# Altium schematic sheet Std 12V.SchDoc
size A4; SheetNumber: 6; SheetTotal: 6
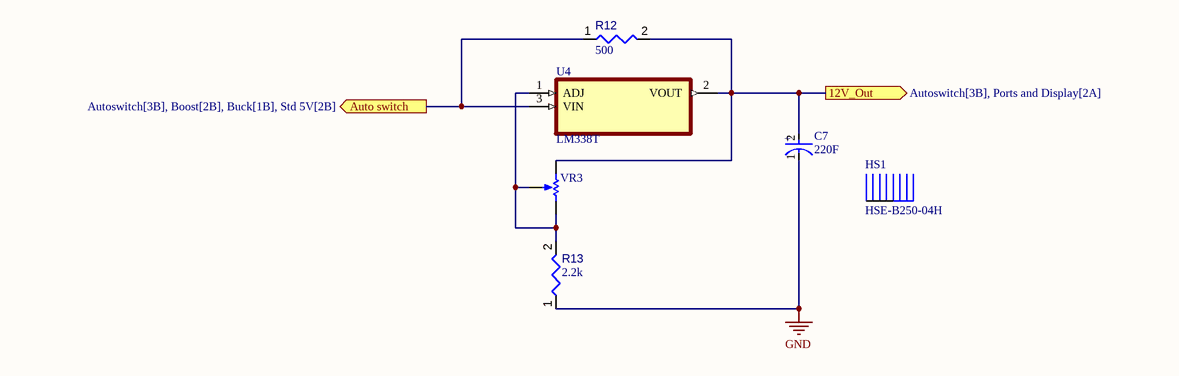
[diagram p0: Std 12V.SchDoc]

## Parts
C7  value 220F  [FP-FTF-MFG]  (hidden comment: Capacitors)
HS1  HSE-B250-04H  [HSINK_HSE-B250-04H]
R12  value 500  [RESC0805(2012)_L]  (hidden comment: 1KR5J)
R13  value 2.2k  [RESC0805(2012)_L]  (hidden comment: 1KR5J)
U4  LM338T  [TO254P1054X470X1955-3]
VR3  3362P-1-103LF  [BOUR-3362P]  (value not drawn)

## Ports
12V_Out (out, see Autoswitch[3B], Ports and Display[2A]), Auto switch (out, see Autoswitch[3B], Boost[2B], Buck[1B], Std 5V[2B])

## Nets
GND: C7.1(C) R13.1
12V_Out: C7.2(A) R12.2 U4.2(VOUT) VR3.1(CCW) ; port 12V_Out
Auto switch: R12.1 U4.3(VIN) ; port Auto switch
NetHS1_1: HS1.1(S) HS1.2(S)
NetR13_2: R13.2 U4.1(ADJ) VR3.2(S) VR3.3(CW)

## Notes on the sheet
- (in symbol CMP-001-00083-1) +

## Library data of the parts
C7 = CMP-001-00083-1: Aluminum Electrolytic Capacitor, Polarized, Aluminum (wet), 50V, 20% +Tol, 20% -Tol, 220uF, Surface Mount, 3333; Dielectric Material: Aluminium; Ripple Current: 435.5mA; Tan Delta: 0.1; ESR (Equivalent Series Resistance): 180mR; Reference Standard: AEC-Q200; Leakage Current: 110uA; RoHS Compliant: Yes; Tolerance (fill in as +-): 20%; Length: 10.2mm; Rated DC Voltage (URdc): 50V; Min Operating Temperature: -55°C; Packaging: Tape and Reel; Max Operating Temperature: 105°C; Case/Package: 3333; Tolerance  (fill in as +-): 20%; Capacitor Type: Aluminium; Termination: Flat; Reach SVHC Compliant: Yes; Pins: 2; Polarity: Polarized; Package Style: SMTMeter; Mounting Technology: Surface Mount; Diameter: 8mm
HS1 = CMP-029-000001-2: Extruded Heat Sink, TO-220, 4 mm Vertical Solder Pin; MF: Same Sky; Value: *; Component Type: Standard; Check_prices: https://www.snapeda.com/parts/HSE-B250-04H/Same+Sky/view-part/?ref=eda; Package: None; SnapEDA_Link: https://www.snapeda.com/parts/HSE-B250-04H/Same+Sky/view-part/?ref=snap; Pin Count: 2; Source: HSE-B250-04H.SchLib; Design Item ID: HSE-B250-04H; MP: HSE-B250-04H
R12 R13 = CMP-009-00076-2: 1K 0.125W 5% 0805 (2012 Metric)  SMD; Power: 125mW; Pins: 2; Mounting Technology: SMT; Tolerance: 5%; Case/Package: 0805
U4 = CMP-021-000000-1: 5-A, 40-V, low-IQ, adjustable linear voltage regulator 3-TO-220 0 to 125; MF: Texas Instruments; Source: LM338T.SchLib; Design Item ID: LM338T; Package: TO-220-3 Texas Instruments; Value: *; Pin Count: 3; MP: LM338T; Component Type: Standard; Check_prices: https://www.snapeda.com/parts/LM338T/Texas+Instruments/view-part/?ref=eda; SnapEDA_Link: https://www.snapeda.com/parts/LM338T/Texas+Instruments/view-part/?ref=snap
VR3 = CMP-009-00039-2: Square Trimpot(R) Trimming Potentiometer, 10 KOhm, 300 V, -55 to 125 degC, 3-Pin THD, RoHS, Tube; Manufacturer: Bourns; Tolerance: 10%; Power: 500mW; Voltage Rating: 300V; Resistance: 10k; Packaging: Rail/Tube; Package Reference: 3326P; Manufacturer URL: http://www.bourns.com/; Composition: Potentiometer; Package Description: 3-Pin Through Hole Device, Body 6.6 x 6.99 mm, Pitch 2.54 mm; Max Operating Temperature: 125°C; Min Operating Temperature: -55°C; Datasheet Version: May-16; Lead Pitch: 2.54mm; Pins: 3; Datasheet URL: http://www.bourns.com/docs/Product-Datasheets/3362.pdf; Package Quantity: 250; Case/Package: 3326P; RoHS Compliant: True; Mounting Technology: TH